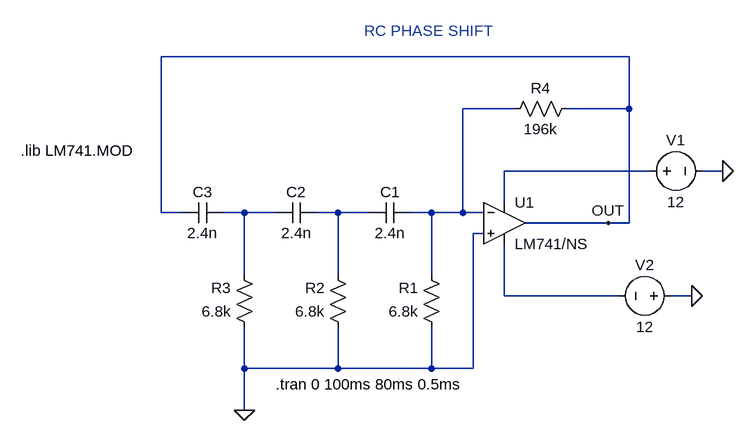
[diagram p0: schematic RC-Phase Shift.asc]
RC-Phase Shift.asc, the LTspice schematic file:
Version 4
SHEET 1 920 680
WIRE 704 -32 -16 -32
WIRE 528 48 448 48
WIRE 704 48 704 -32
WIRE 704 48 608 48
WIRE 736 144 512 144
WIRE 848 144 816 144
WIRE 512 192 512 144
WIRE -16 208 -16 -32
WIRE 16 208 -16 208
WIRE 112 208 80 208
WIRE 160 208 112 208
WIRE 256 208 224 208
WIRE 304 208 256 208
WIRE 400 208 368 208
WIRE 448 208 448 48
WIRE 448 208 400 208
WIRE 480 208 448 208
WIRE 672 224 544 224
WIRE 704 224 704 48
WIRE 704 224 672 224
WIRE 480 240 464 240
WIRE 112 304 112 208
WIRE 256 304 256 208
WIRE 400 304 400 208
WIRE 512 336 512 256
WIRE 688 336 512 336
WIRE 800 336 768 336
WIRE 112 448 112 384
WIRE 256 448 256 384
WIRE 256 448 112 448
WIRE 400 448 400 384
WIRE 400 448 256 448
WIRE 464 448 464 240
WIRE 464 448 400 448
WIRE 112 512 112 448
FLAG 112 512 0
FLAG 800 336 0
FLAG 848 144 0
FLAG 672 224 OUT
SYMBOL cap 80 192 R90
WINDOW 0 0 32 VBottom 2
WINDOW 3 32 32 VTop 2
SYMATTR InstName C3
SYMATTR Value 2.4n
SYMBOL cap 224 192 R90
WINDOW 0 0 32 VBottom 2
WINDOW 3 32 32 VTop 2
SYMATTR InstName C2
SYMATTR Value 2.4n
SYMBOL cap 368 192 R90
WINDOW 0 0 32 VBottom 2
WINDOW 3 32 32 VTop 2
SYMATTR InstName C1
SYMATTR Value 2.4n
SYMBOL res 416 400 R180
WINDOW 0 36 76 Left 2
WINDOW 3 36 40 Left 2
SYMATTR InstName R1
SYMATTR Value 6.8k
SYMBOL res 272 400 R180
WINDOW 0 36 76 Left 2
WINDOW 3 36 40 Left 2
SYMATTR InstName R2
SYMATTR Value 6.8k
SYMBOL res 128 400 R180
WINDOW 0 36 76 Left 2
WINDOW 3 36 40 Left 2
SYMATTR InstName R3
SYMATTR Value 6.8k
SYMBOL res 512 64 R270
WINDOW 0 32 56 VTop 2
WINDOW 3 0 56 VBottom 2
SYMATTR InstName R4
SYMATTR Value 196k
SYMBOL voltage 720 144 R270
WINDOW 0 32 56 VTop 2
WINDOW 3 -32 56 VBottom 2
SYMATTR InstName V1
SYMATTR Value 12
SYMBOL voltage 784 336 R90
WINDOW 0 -32 56 VBottom 2
WINDOW 3 32 56 VTop 2
SYMATTR InstName V2
SYMATTR Value 12
SYMBOL OpAmps\\opamp2 512 160 R0
SYMATTR InstName U1
SYMATTR Value LM741/NS
TEXT 160 472 Left 2 !.tran 0 100ms 80ms 0.5ms
TEXT -232 112 Left 2 !.lib LM741.MOD
TEXT 296 -72 Left 2 ;RC PHASE SHIFT

The netlist it stands for:
* RC-Phase Shift.asc
C3 N003 OUT 2.4n
C2 N004 N003 2.4n
C1 N001 N004 2.4n
R1 0 N001 6.8k
R2 0 N004 6.8k
R3 0 N003 6.8k
R4 N001 OUT 196k
V1 N002 0 12
V2 0 N005 12
XU1 0 N001 N002 N005 OUT LM741/NS  ; pins In+ In- V+ V- OUT
.tran 0 100ms 80ms 0.5ms
.lib LM741.MOD
* RC PHASE SHIFT
.backanno
.end